# Altium schematic sheet Master.SchDoc
size A3
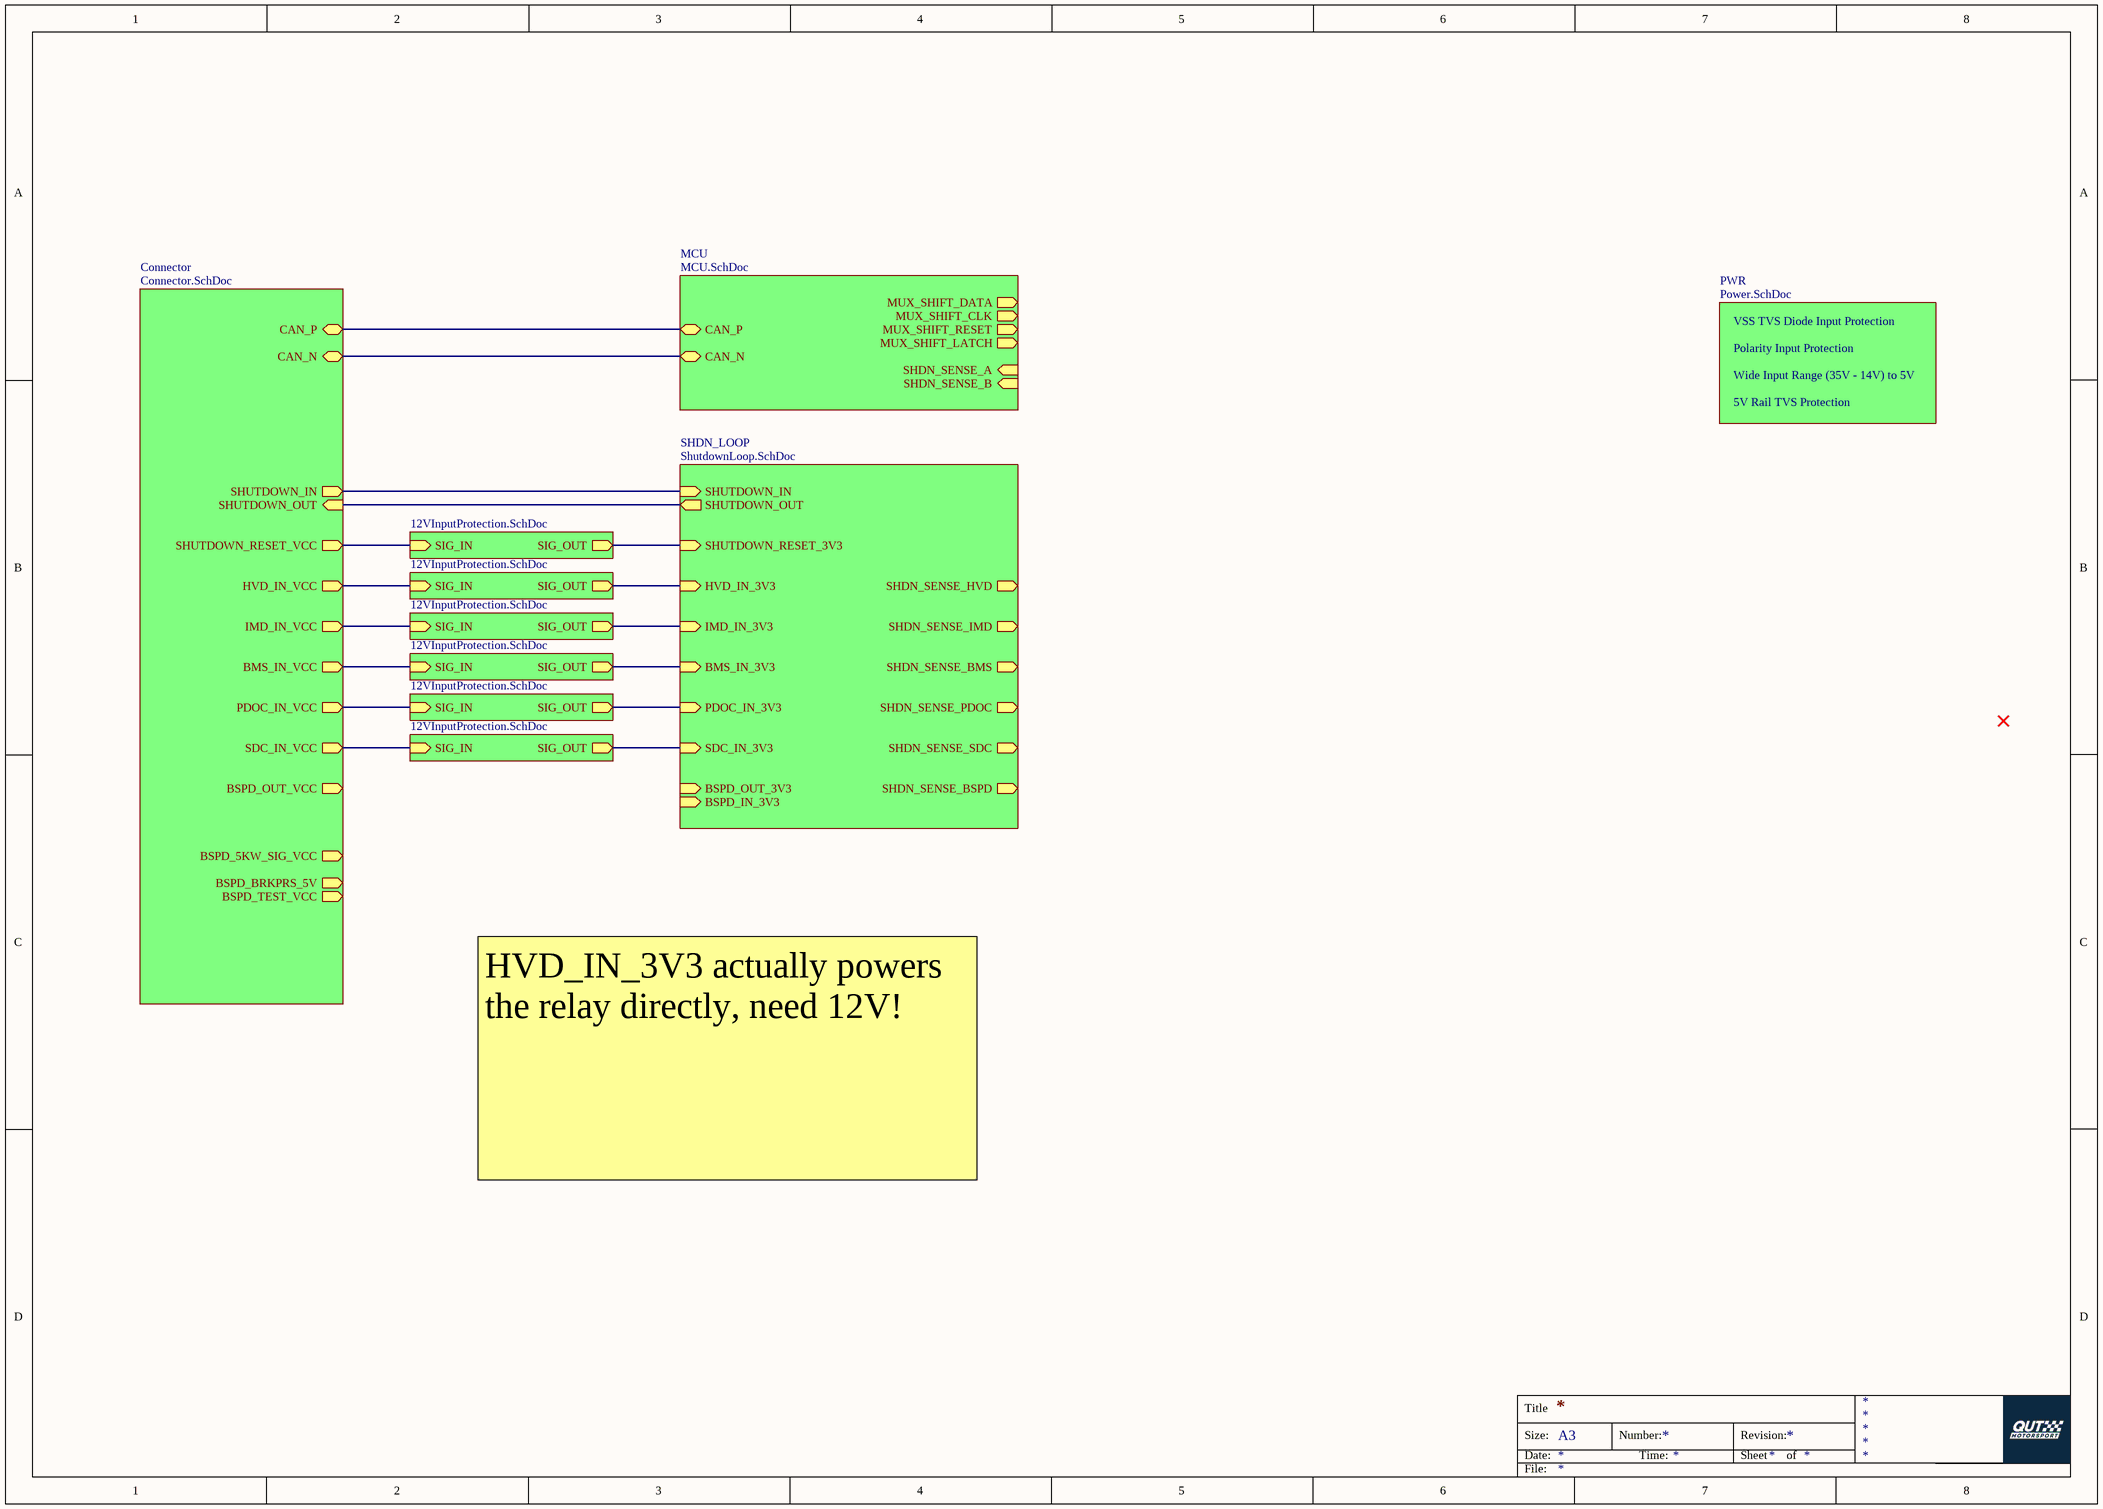
[diagram p0: Master.SchDoc]

## Sub-sheets
Connector = Connector.SchDoc: CAN_N (bidir), CAN_P (bidir), SHUTDOWN_IN (out), SHUTDOWN_OUT (in), HVD_IN_VCC (out), BMS_IN_VCC (out), SHUTDOWN_RESET_VCC (out), SDC_IN_VCC (out), BSPD_OUT_VCC (out), BSPD_BRKPRS_5V (out), PDOC_IN_VCC (out), BSPD_TEST_VCC (out), IMD_IN_VCC (out), BSPD_5KW_SIG_VCC (out)
MCU = MCU.SchDoc: SHDN_SENSE_B (in), SHDN_SENSE_A (in), MUX_SHIFT_LATCH (out), MUX_SHIFT_RESET (out), MUX_SHIFT_CLK (out), MUX_SHIFT_DATA (out), CAN_P (bidir), CAN_N (bidir)
PWR = Power.SchDoc: no entries
SHDN_LOOP = ShutdownLoop.SchDoc: SHDN_SENSE_BSPD (out), SHDN_SENSE_PDOC (out), SHDN_SENSE_BMS (out), SHDN_SENSE_IMD (out), SHUTDOWN_OUT (out), SHUTDOWN_IN (in), SHDN_SENSE_HVD (out), SHDN_SENSE_SDC (out), BSPD_IN_3V3 (in), SDC_IN_3V3 (in), SHUTDOWN_RESET_3V3 (in), BMS_IN_3V3 (in), IMD_IN_3V3 (in), PDOC_IN_3V3 (in), HVD_IN_3V3 (in), BSPD_OUT_3V3 (in)
SHDN_RESET_PROTECTION = 12VInputProtection.SchDoc: SIG_OUT (out), SIG_IN (in)
SHDN_RESET_PROTECTION = 12VInputProtection.SchDoc: SIG_OUT (out), SIG_IN (in)
SHDN_RESET_PROTECTION = 12VInputProtection.SchDoc: SIG_OUT (out), SIG_IN (in)
SHDN_RESET_PROTECTION = 12VInputProtection.SchDoc: SIG_OUT (out), SIG_IN (in)
SHDN_RESET_PROTECTION = 12VInputProtection.SchDoc: SIG_OUT (out), SIG_IN (in)
SHDN_RESET_PROTECTION = 12VInputProtection.SchDoc: SIG_OUT (out), SIG_IN (in)

## Nets
(unnamed): sheet Connector/CAN_N, sheet MCU/CAN_N
(unnamed): sheet Connector/CAN_P, sheet MCU/CAN_P
(unnamed): sheet Connector/SHUTDOWN_IN, sheet SHDN_LOOP/SHUTDOWN_IN
(unnamed): sheet Connector/SHUTDOWN_OUT, sheet SHDN_LOOP/SHUTDOWN_OUT
(unnamed): sheet Connector/HVD_IN_VCC, sheet SHDN_RESET_PROTECTION/SIG_IN
(unnamed): sheet Connector/BMS_IN_VCC, sheet SHDN_RESET_PROTECTION/SIG_IN
(unnamed): sheet Connector/SHUTDOWN_RESET_VCC, sheet SHDN_RESET_PROTECTION/SIG_IN
(unnamed): sheet Connector/SDC_IN_VCC, sheet SHDN_RESET_PROTECTION/SIG_IN
(unnamed): sheet Connector/PDOC_IN_VCC, sheet SHDN_RESET_PROTECTION/SIG_IN
(unnamed): sheet Connector/IMD_IN_VCC, sheet SHDN_RESET_PROTECTION/SIG_IN
(unnamed): sheet SHDN_LOOP/SDC_IN_3V3, sheet SHDN_RESET_PROTECTION/SIG_OUT
(unnamed): sheet SHDN_LOOP/SHUTDOWN_RESET_3V3, sheet SHDN_RESET_PROTECTION/SIG_OUT
(unnamed): sheet SHDN_LOOP/BMS_IN_3V3, sheet SHDN_RESET_PROTECTION/SIG_OUT
(unnamed): sheet SHDN_LOOP/IMD_IN_3V3, sheet SHDN_RESET_PROTECTION/SIG_OUT
(unnamed): sheet SHDN_LOOP/PDOC_IN_3V3, sheet SHDN_RESET_PROTECTION/SIG_OUT
(unnamed): sheet SHDN_LOOP/HVD_IN_3V3, sheet SHDN_RESET_PROTECTION/SIG_OUT

## Notes on the sheet
- VSS TVS Diode Input Protection
- Polarity Input Protection
- Wide Input Range (35V - 14V) to 5V
- 5V Rail TVS Protection
- HVD_IN_3V3 actually powers the relay directly, need 12V!
- Title
- Size:
- Date:
- A3
- Number:
- Time:
- Revision:
- Sheet
- of
- File: